# EAGLE schematic ATtiny Motor Controller -- BREAKOUT (EAGLE 6.4)
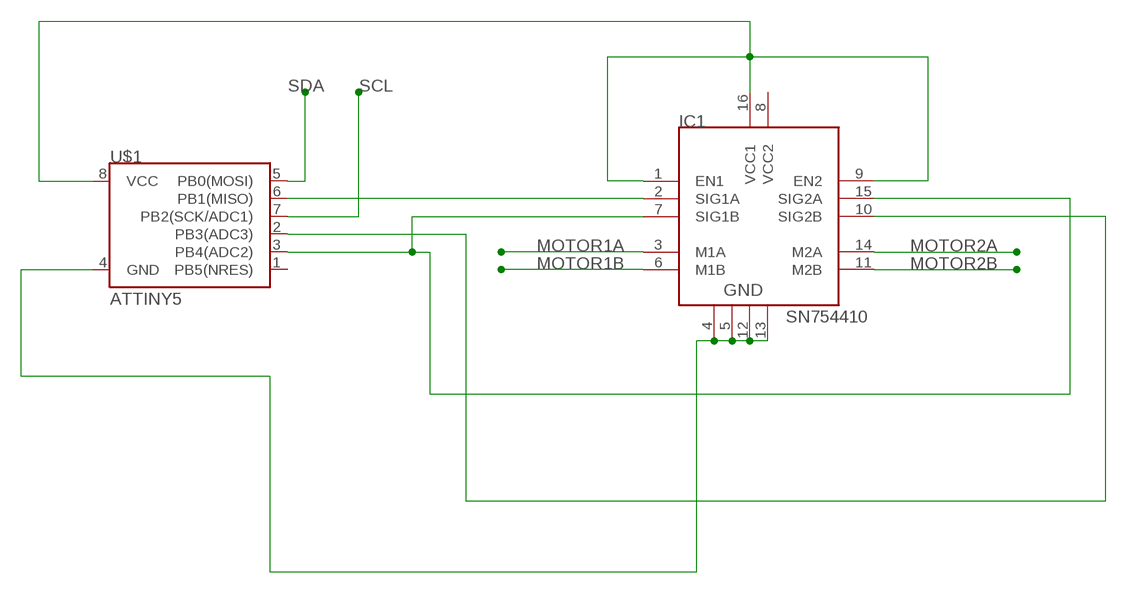
[diagram p0: schematic, sheet 1]

## Parts
IC1  SN754410  [DIP16]
U$1  ATTINY5  ATTINY45  [SO08-EIAJ]

## Nets
MOTOR1A: IC1.3(M1A)
MOTOR1B: IC1.6(M1B)
MOTOR2A: IC1.14(M2A)
MOTOR2B: IC1.11(M2B)
N$1: IC1.4 IC1.5 IC1.12 IC1.13 U$1.4(GND)
N$2: IC1.2(SIG1A) U$1.6(PB1(MISO))
N$3: IC1.1(EN1) IC1.9(EN2) IC1.16(VCC1) U$1.8(VCC)
N$4: IC1.10(SIG2B) U$1.2(PB3(ADC3))
N$5: IC1.7(SIG1B) IC1.15(SIG2A) U$1.3(PB4(ADC2))
SCL: U$1.7(PB2(SCK/ADC1))
SDA: U$1.5(PB0(MOSI))
Unconnected: U$1.1(PB5(NRES))

## Power pins joined to a net without a drawn wire
VCC2: IC1.8(VCC2)

## Library data of the parts
IC1 = HBridge:SN754410: Quadruple half-H driver
U$1 = SparkFun:ATTINY45: Atmel ATTiny45